# EAGLE design M100A (EAGLE 6.6.0)
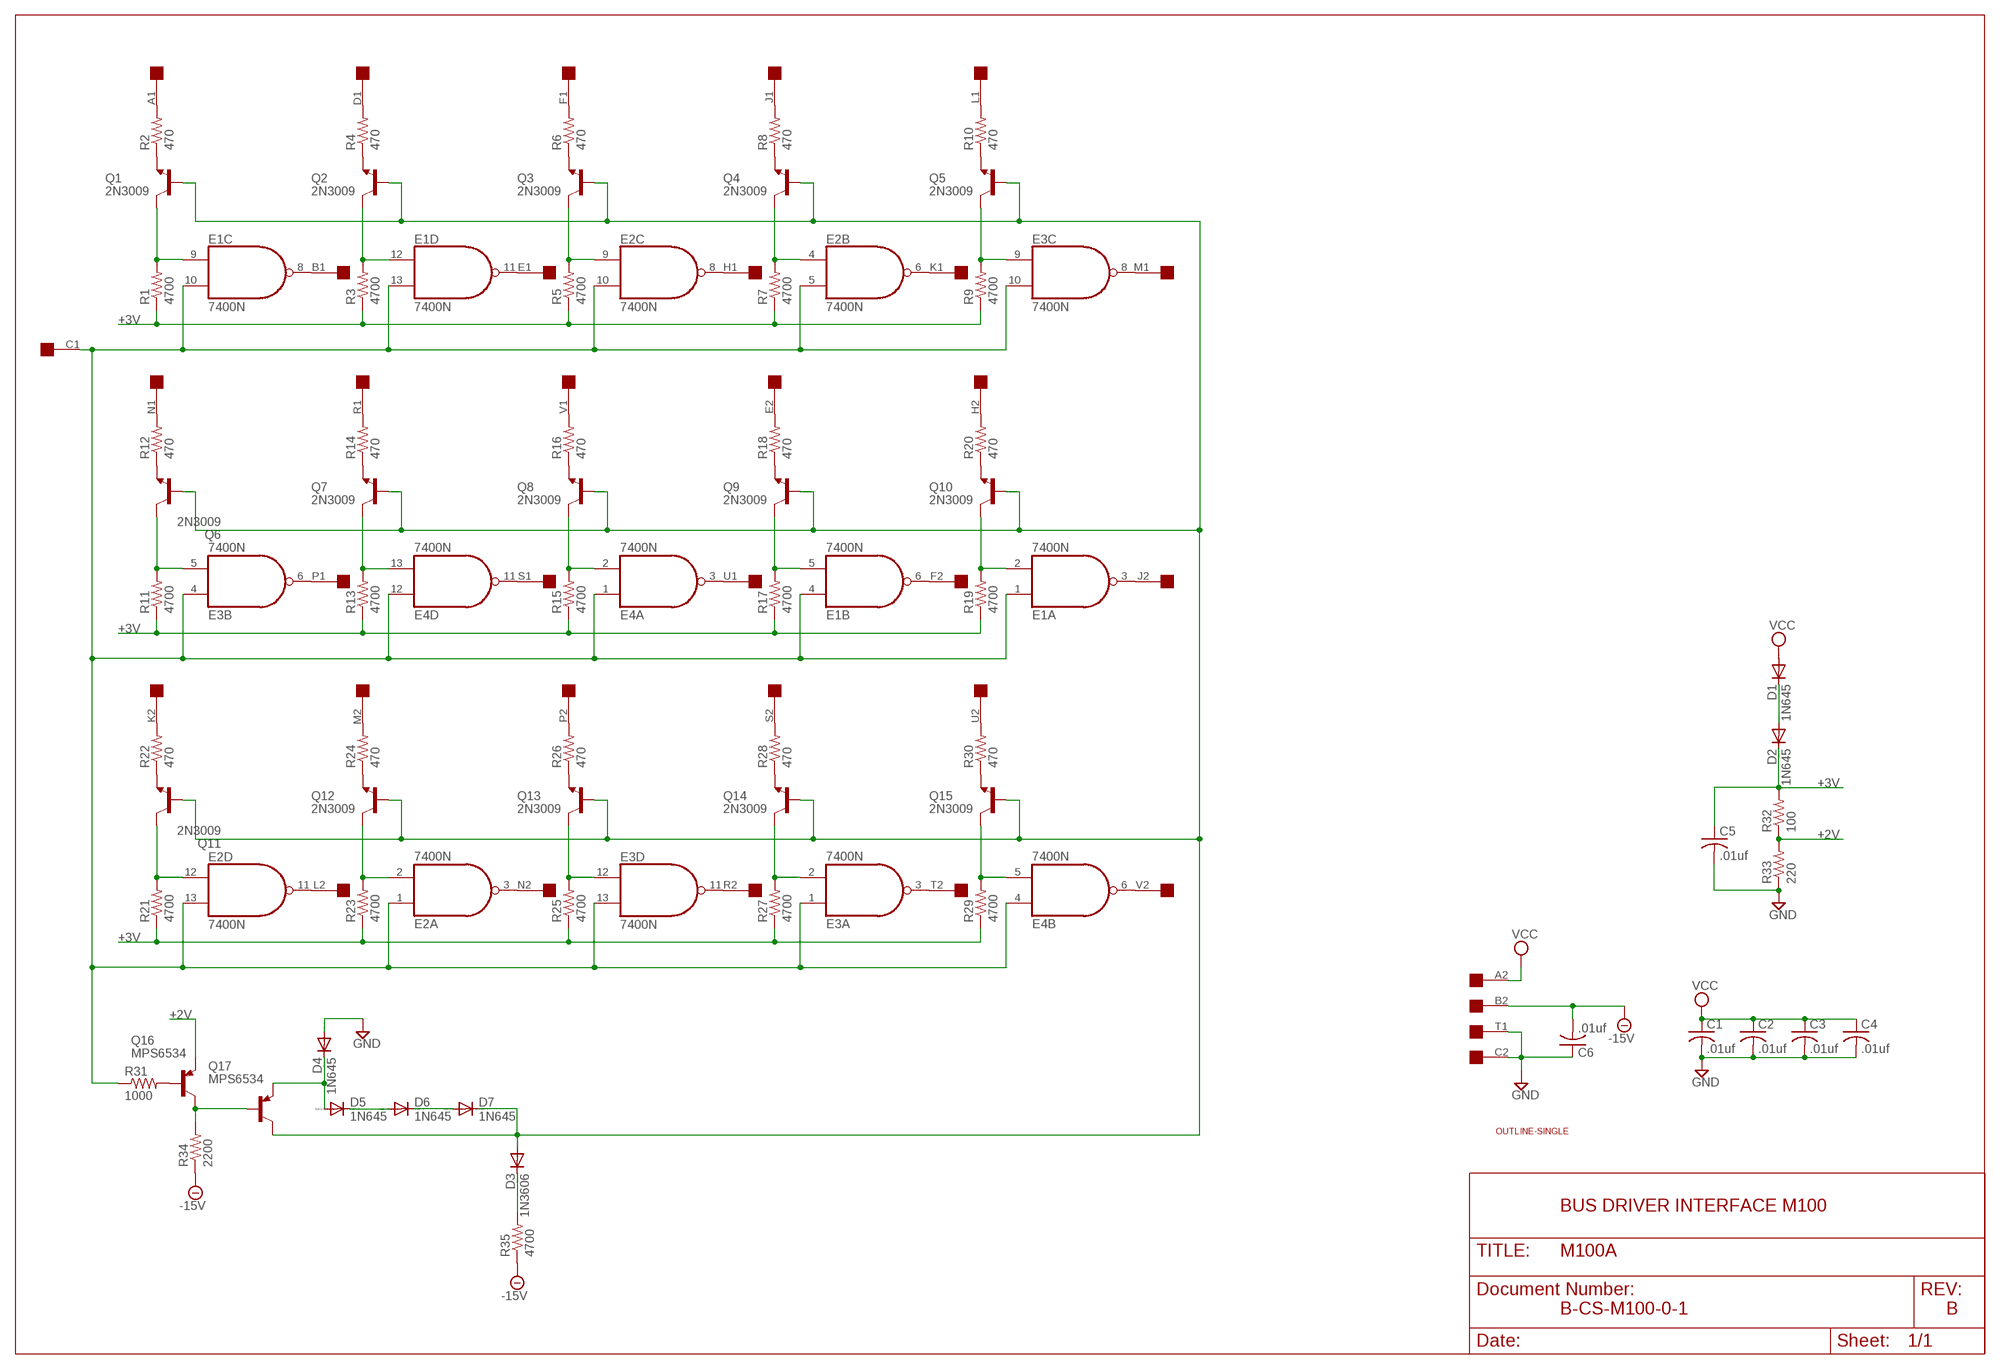
[diagram p0: schematic, sheet 1]

## Parts
C1  .01uf  C-US050-025X075  [C050-025X075]
C2  .01uf  C-US050-025X075  [C050-025X075]
C3  .01uf  C-US050-025X075  [C050-025X075]
C4  .01uf  C-US050-025X075  [C050-025X075]
C5  .01uf  C-US050-025X075  [C050-025X075]
C6  .01uf  C-US050-025X075  [C050-025X075]
D1  1N645  1N4148DO35-10  [DO35-10]
D2  1N645  1N4148DO35-10  [DO35-10]
D3  1N3606  1N4148DO35-10  [DO35-10]
D4  1N645  1N4148DO35-10  [DO35-10]
D5  1N645  1N4148DO35-10  [DO35-10]
D6  1N645  1N4148DO35-10  [DO35-10]
D7  1N645  1N4148DO35-10  [DO35-10]
E1  7400N  [DIL14]
E2  7400N  [DIL14]
E3  7400N  [DIL14]
E4  7400N  [DIL14]
Q1  2N3009  2N2219  [TO5]
Q2  2N3009  2N2219  [TO5]
Q3  2N3009  2N2219  [TO5]
Q4  2N3009  2N2219  [TO5]
Q5  2N3009  2N2219  [TO5]
Q6  2N3009  2N2219  [TO5]
Q7  2N3009  2N2219  [TO5]
Q8  2N3009  2N2219  [TO5]
Q9  2N3009  2N2219  [TO5]
Q10  2N3009  2N2219  [TO5]
Q11  2N3009  2N2219  [TO5]
Q12  2N3009  2N2219  [TO5]
Q13  2N3009  2N2219  [TO5]
Q14  2N3009  2N2219  [TO5]
Q15  2N3009  2N2219  [TO5]
Q16  MPS6534  -PNP-TO5  [TO5]
Q17  MPS6534  -PNP-TO5  [TO5]
R1  4700  R-US_0207/10  [0207/10]
R2  470  R-US_0207/10  [0207/10]
R3  4700  R-US_0207/10  [0207/10]
R4  470  R-US_0207/10  [0207/10]
R5  4700  R-US_0207/10  [0207/10]
R6  470  R-US_0207/10  [0207/10]
R7  4700  R-US_0207/10  [0207/10]
R8  470  R-US_0207/10  [0207/10]
R9  4700  R-US_0207/10  [0207/10]
R10  470  R-US_0207/10  [0207/10]
R11  4700  R-US_0207/10  [0207/10]
R12  470  R-US_0207/10  [0207/10]
R13  4700  R-US_0207/10  [0207/10]
R14  470  R-US_0207/10  [0207/10]
R15  4700  R-US_0207/10  [0207/10]
R16  470  R-US_0207/10  [0207/10]
R17  4700  R-US_0207/10  [0207/10]
R18  470  R-US_0207/10  [0207/10]
R19  4700  R-US_0207/10  [0207/10]
R20  470  R-US_0207/10  [0207/10]
R21  4700  R-US_0207/10  [0207/10]
R22  470  R-US_0207/10  [0207/10]
R23  4700  R-US_0207/10  [0207/10]
R24  470  R-US_0207/10  [0207/10]
R25  4700  R-US_0207/10  [0207/10]
R26  470  R-US_0207/10  [0207/10]
R27  4700  R-US_0207/10  [0207/10]
R28  470  R-US_0207/10  [0207/10]
R29  4700  R-US_0207/10  [0207/10]
R30  470  R-US_0207/10  [0207/10]
R31  1000  R-US_0207/10  [0207/10]
R32  100  R-US_0207/10  [0207/10]
R33  220  R-US_0207/10  [0207/10]
R34  2200  R-US_0207/10  [0207/10]
R35  4700  R-US_0207/10  [0207/10]
U$1  SINGLE  [EDGE-CON2]
U$2  OUTLINE-SINGLE  [SINGLE]

## Nets
+2V: Q16.1(E) R32.1 R33.2
+3V: C5.1 D2.C R1.1 R3.1 R5.1 R7.1 R9.1 R11.1 R13.1 R15.1 R17.1 R19.1 R21.1 R23.1 R25.1 R27.1 R29.1 R32.2
-15V: C6.2 R34.1 R35.1 U$1.B2
GND [Supply]: C1.2 C2.2 C3.2 C4.2 C5.2 C6.1 D4.A R33.1 U$1.C2 U$1.T1
N$1: Q1.1(E) R2.1
N$2: E1.9(C:I0) Q1.3(C) R1.2
N$4: E1.1(A:I0) E1.4(B:I0) E1.10(C:I1) E1.13(D:I1) E2.1(A:I0) E2.5(B:I1) E2.10(C:I1) E2.13(D:I1) E3.1(A:I0) E3.4(B:I0) E3.10(C:I1) E3.13(D:I1) E4.1(A:I0) E4.4(B:I0) E4.12(D:I0) R31.1 U$1.C1
N$5: E1.12(D:I0) Q2.3(C) R3.2
N$6: E1.8(C:O) U$1.B1
N$7: Q2.1(E) R4.1
N$8: R4.2 U$1.D1
N$9: E1.11(D:O) U$1.E1
N$10: R6.2 U$1.F1
N$11: Q3.1(E) R6.1
N$12: E2.9(C:I0) Q3.3(C) R5.2
N$13: E2.8(C:O) U$1.H1
N$14: R8.2 U$1.J1
N$15: Q4.1(E) R8.1
N$16: E2.4(B:I0) Q4.3(C) R7.2
N$17: E2.6(B:O) U$1.K1
N$18: R10.2 U$1.L1
N$19: E3.8(C:O) U$1.M1
N$20: E3.9(C:I0) Q5.3(C) R9.2
N$21: Q5.1(E) R10.1
N$22: D3.A D7.C Q1.2(B) Q2.2(B) Q3.2(B) Q4.2(B) Q5.2(B) Q6.2(B) Q7.2(B) Q8.2(B) Q9.2(B) Q10.2(B) Q11.2(B) Q12.2(B) Q13.2(B) Q14.2(B) Q15.2(B) Q17.3(C)
N$23: R12.2 U$1.N1
N$24: Q6.1(E) R12.1
N$25: E3.5(B:I1) Q6.3(C) R11.2
N$26: E3.6(B:O) U$1.P1
N$27: E4.11(D:O) U$1.S1
N$28: Q7.1(E) R14.1
N$29: R14.2 U$1.R1
N$30: E4.13(D:I1) Q7.3(C) R13.2
N$31: E4.3(A:O) U$1.U1
N$32: R16.2 U$1.V1
N$33: R2.2 U$1.A1
N$34: E4.2(A:I1) Q8.3(C) R15.2
N$35: R18.2 U$1.E2
N$36: E1.6(B:O) U$1.F2
N$37: R20.2 U$1.H2
N$38: Q8.1(E) R16.1
N$39: Q9.1(E) R18.1
N$40: E1.5(B:I1) Q9.3(C) R17.2
N$41: E1.3(A:O) U$1.J2
N$42: R22.2 U$1.K2
N$43: E1.2(A:I1) Q10.3(C) R19.2
N$44: Q10.1(E) R20.1
N$45: Q11.1(E) R22.1
N$46: E2.12(D:I0) Q11.3(C) R21.2
N$47: E2.11(D:O) U$1.L2
N$48: R24.2 U$1.M2
N$49: Q12.1(E) R24.1
N$50: E2.3(A:O) U$1.N2
N$51: E2.2(A:I1) Q12.3(C) R23.2
N$52: R26.2 U$1.P2
N$53: E3.11(D:O) U$1.R2
N$54: E3.12(D:I0) Q13.3(C) R25.2
N$55: R28.2 U$1.S2
N$56: E3.3(A:O) U$1.T2
N$57: R30.2 U$1.U2
N$58: Q13.1(E) R26.1
N$59: Q14.1(E) R28.1
N$60: E3.2(A:I1) Q14.3(C) R27.2
N$61: E4.6(B:O) U$1.V2
N$62: D1.C D2.A
N$63: E4.5(B:I1) Q15.3(C) R29.2
N$64: Q15.1(E) R30.1
N$65: D3.C R35.2
N$66: D5.C D6.A
N$67: D6.C D7.A
N$68: Q16.2(B) R31.2
N$69: Q16.3(C) Q17.2(B) R34.2
N$70: D4.C D5.A Q17.1(E)
VCC [Supply]: C1.1 C2.1 C3.1 C4.1 D1.A U$1.A2
Unconnected: E4.8(C:O) E4.9(C:I0) E4.10(C:I1) U$1.D2

## Notes on the sheet
- BUS DRIVER INTERFACE M100
- B-CS-M100-0-1 | B

## Power pins joined to a net without a drawn wire
GND: E1.7(P:GND) E2.7(P:GND) E3.7(P:GND) E4.7(P:GND)
VCC: E1.14(P:VCC) E2.14(P:VCC) E3.14(P:VCC) E4.14(P:VCC)

## Library data of the parts
C1-C6 = rcl:C-US: CAPACITOR, American symbol
D1-D7 = diode:1N4148: DIODE high speed (Philips)
E1-E4 = 74xx-us:74*00: Quad 2-input NAND gate
Q1-Q15 = transistor:2N2219: NPN TRANSISTOR
Q16 Q17 = transistor:*-PNP-: PNP Transistror
R1-R35 = rcl:R-US_: RESISTOR, American symbol
U$1 = dec-con:SINGLE: Single-Height DEC board
U$2 = dec-con:OUTLINE-*: Board outlines for DEC boards.

## Net classes
1 Supply: width 0.813 mm
2 HighCurrent: width 1.422 mm

## Board
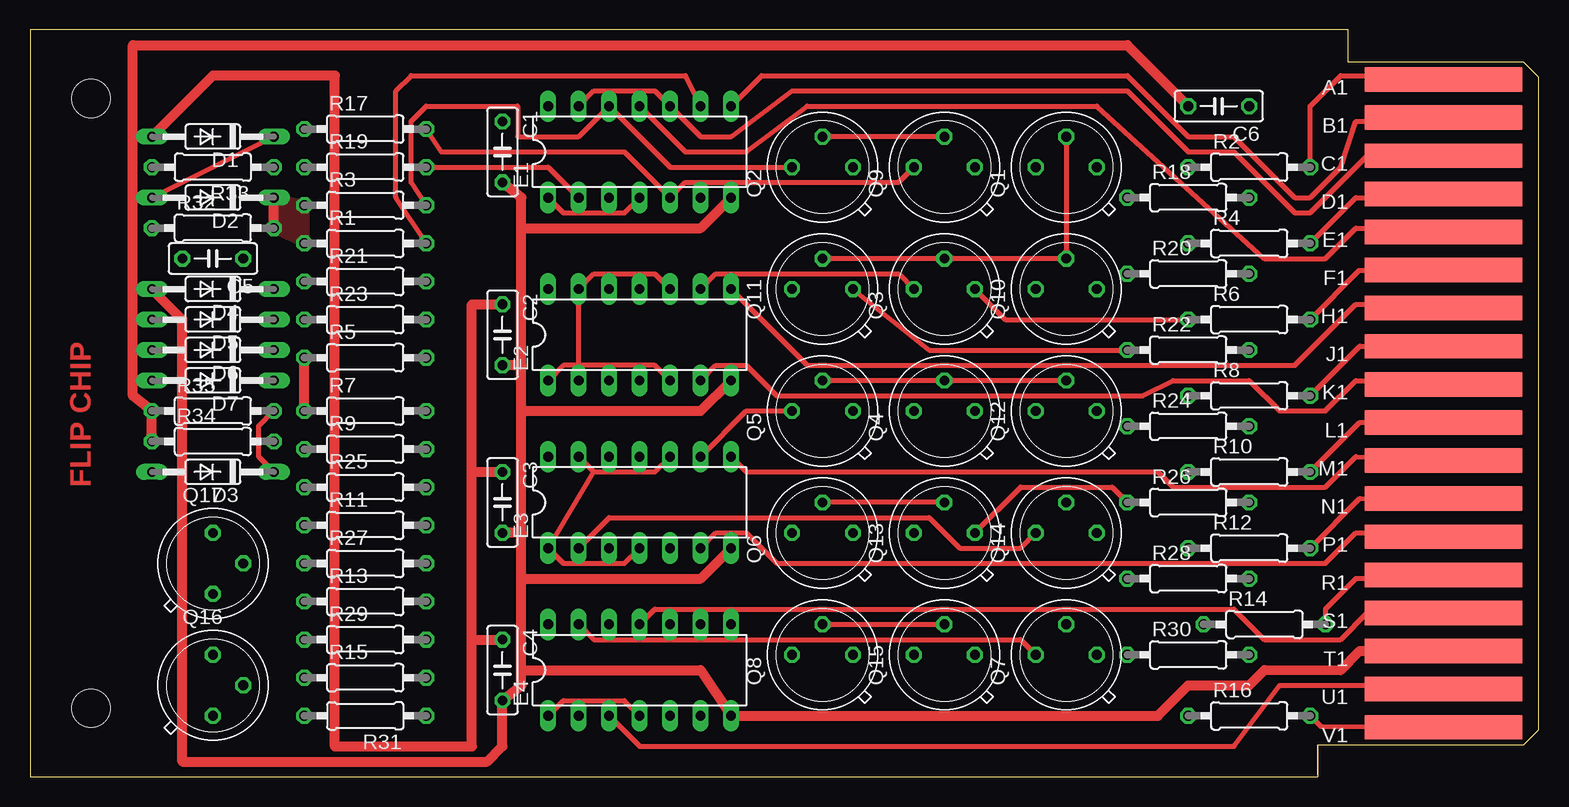
[diagram p1: board, top side]
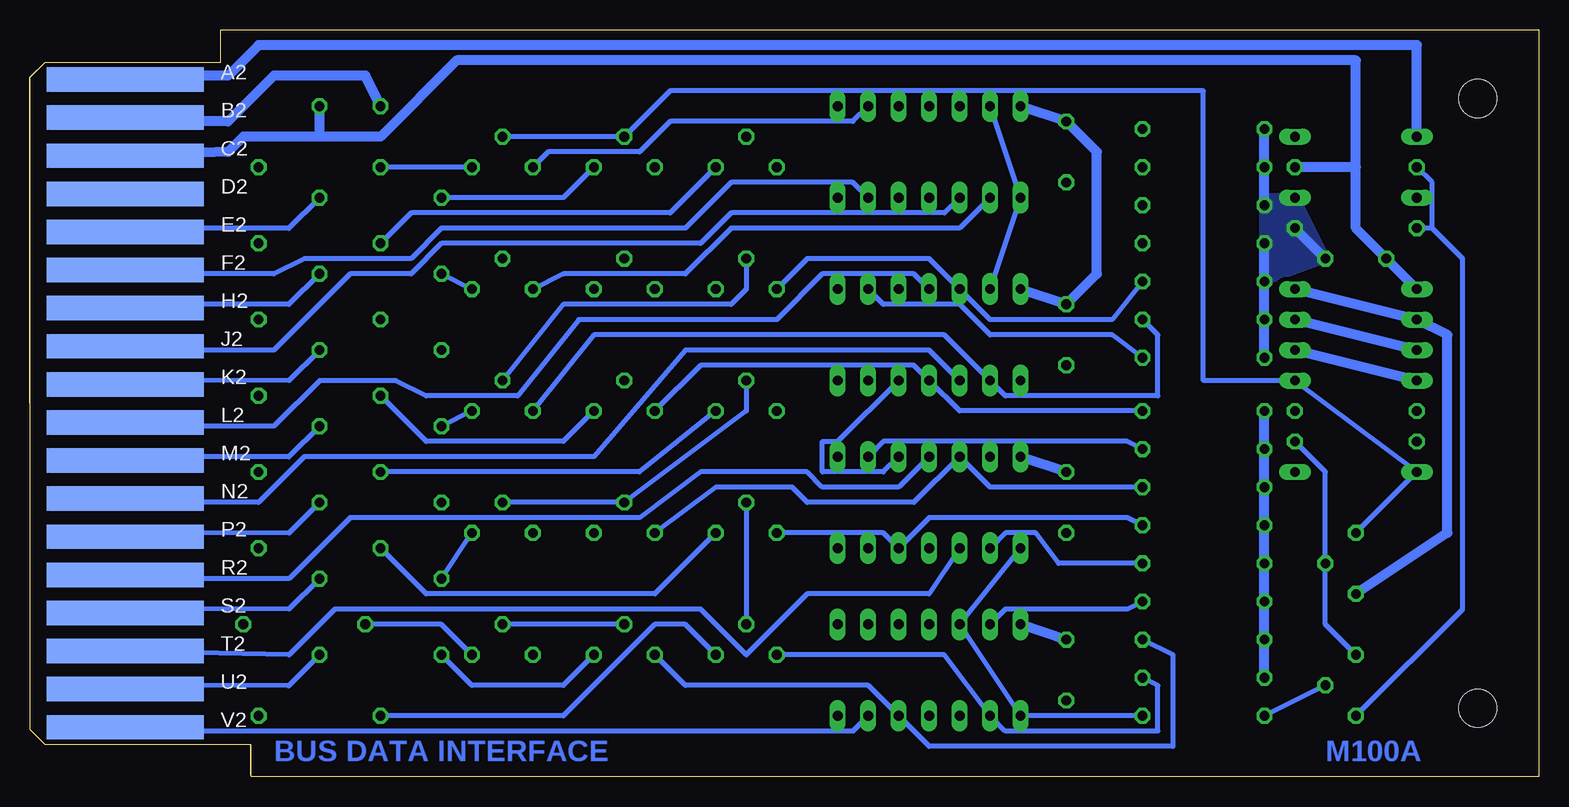
[diagram p2: board, bottom side, seen from below]

Size 125.73 x 62.23 mm. Coordinates in mm from the lower left corner, seen from the top.
Copper layers (1+16): Top 0.035mm / dielectric 1.5mm / Bottom 0.035mm
Design rules "16mils": minimum track width 16mil, minimum drill 32mil, track to track 15mil, track to pad 10mil, pad to pad 10mil, via to via 10mil, smd to smd 10mil, copper to edge 13mil, drill to drill 10mil, minimum pad ring 10mil, minimum via ring 8mil, stop-mask expansion 0mil, vias tented up to drill 0mil, thermal gap 10mil

### Footprints (pad centres in the part's own frame; a part is rotated, then mirrored left to right if it is on the bottom)
C050-025X075 = drill 0.813 octagon: 1 -2.54,0; 2 2.54,0
DO35-10 = drill 0.813 long: A 5.08,0; C -5.08,0
DIL14 = drill 0.813 long: 1 -7.62,-3.81; 2 -5.08,-3.81; 3 -2.54,-3.81; 4 0,-3.81; 5 2.54,-3.81; 6 5.08,-3.81; 7 7.62,-3.81; 8 7.62,3.81; 9 5.08,3.81; 10 2.54,3.81; 11 0,3.81; 12 -2.54,3.81; 13 -5.08,3.81; 14 -7.62,3.81
TO5 = drill 0.813 octagon: 1 0,-2.54; 2 2.54,0; 3 0,2.54
0207/10 = drill 0.813 octagon: 1 -5.08,0; 2 5.08,0
EDGE-CON2 = smd 13.106 x 2.032: A1 7.938,4.128; B1 7.938,7.303; C1 7.938,10.477; D1 7.938,13.652; E1 7.938,16.828; F1 7.938,20.003; H1 7.938,23.177; J1 7.938,26.352; K1 7.938,29.527; L1 7.938,32.703; M1 7.938,35.877; N1 7.938,39.053; P1 7.938,42.227; R1 7.938,45.403; S1 7.938,48.578; T1 7.938,51.752; U1 7.938,54.928; V1 7.938,58.102 | smd 13.106 x 2.032 bottom: A2 7.938,4.128; B2 7.938,7.303; C2 7.938,10.477; D2 7.938,13.652; E2 7.938,16.828; F2 7.938,20.003; H2 7.938,23.177; J2 7.938,26.352; K2 7.938,29.527; L2 7.938,32.703; M2 7.938,35.877; N2 7.938,39.053; P2 7.938,42.227; R2 7.938,45.403; S2 7.938,48.578; T2 7.938,51.752; U2 7.938,54.928; V2 7.938,58.102
SINGLE = hole 3.175: 120.65,56.515; 120.65,5.715

### Placement (x,y rotation side)
C1  39.37,52.07 270 top
C2  39.37,36.83 270 top
C3  39.37,22.86 270 top
C4  39.37,8.89 270 top
C5  15.24,43.18 180 top
C6  99.06,55.88 180 top
D1  15.24,53.34 180 top
D2  15.24,48.26 180 top
D3  15.24,25.4 180 top
D4  15.24,40.64 180 top
D5  15.24,38.1 180 top
D6  15.24,35.56 180 top
D7  15.24,33.02 180 top
E1  50.8,52.07 0 top
E2  50.8,36.83 0 top
E3  50.8,22.86 0 top
E4  50.8,8.89 0 top
Q1  86.36,50.8 90 top
Q2  66.04,50.8 90 top
Q3  76.2,40.64 90 top
Q4  76.2,30.48 90 top
Q5  66.04,30.48 90 top
Q6  66.04,20.32 90 top
Q7  86.36,10.16 90 top
Q8  66.04,10.16 90 top
Q9  76.2,50.8 90 top
Q10  86.36,40.64 90 top
Q11  66.04,40.64 90 top
Q12  86.36,30.48 90 top
Q13  76.2,20.32 90 top
Q14  86.36,20.32 90 top
Q15  76.2,10.16 90 top
Q16  15.24,7.62 0 top
Q17  15.24,17.78 0 top
R1  27.94,44.45 0 top
R2  101.6,50.8 0 top
R3  27.94,47.62 0 top
R4  101.6,44.45 0 top
R5  27.94,34.92 0 top
R6  101.6,38.1 0 top
R7  27.94,30.48 0 top
R8  101.6,31.75 0 top
R9  27.94,27.3 0 top
R10  101.6,25.4 0 top
R11  27.94,20.95 0 top
R12  101.6,19.05 0 top
R13  27.94,14.61 0 top
R14  102.87,12.7 0 top
R15  27.94,8.26 0 top
R16  101.6,5.08 0 top
R17  27.94,53.98 0 top
R18  96.52,48.26 0 top
R19  27.94,50.8 0 top
R20  96.52,41.91 0 top
R21  27.94,41.27 0 top
R22  96.52,35.56 0 top
R23  27.94,38.1 0 top
R24  96.52,29.21 0 top
R25  27.94,24.13 0 top
R26  96.52,22.86 0 top
R27  27.94,17.78 0 top
R28  96.52,16.51 0 top
R29  27.94,11.43 0 top
R30  96.52,10.16 0 top
R31  27.94,5.08 180 top
R32  15.24,45.72 0 top
R33  15.24,50.8 180 top
R34  15.24,27.94 0 top
R35  15.24,30.48 0 top
U$1  125.73,62.23 180 top
U$2  125.73,62.23 180 top

### Tracks (layer width: path | path; a pad name or v marks a point on that pad's centre or on a via)
+2V
  Bottom 0.406: Q16.1 6.35,13.97 6.35,43.18 8.89,45.72 | 8.89,45.72 R32.1 | R33.2 8.89,49.53 8.89,45.72
+3V
  Top 0.813: R32.2 D2.C | R7.1 R5.1
  Bottom 0.813: R15.1 R29.1 R13.1 R27.1 R11.1 R25.1 R9.1 R7.1 | C5.1 R32.2 | R17.1 R19.1 R3.1 | R1.1 R21.1 R23.1 R5.1
  pour Top (no thermals): 20.32,48.26 22.86,47.62 22.86,44.45 20.32,45.72
  pour Bottom (no thermals): 17.78,43.18 22.86,41.27 22.86,48.26 20.32,48.26
-15V
  Top 0.813: R34.1 R35.1 8.57,31.75 8.57,60.96 91.44,60.96 C6.2
  Bottom 0.813: U$1.B2 111.76,54.61 109.22,54.61 105.41,58.42 97.79,58.42 C6.2
GND
  Top 0.813: U$1.T1 113.03,10.16 112.7,10.49 110.82,10.49 109.22,8.89 102.88,8.9 101.6,7.62 96.52,7.62 93.98,5.08 E4.7 55.88,8.89 40.96,8.89 | 40.96,8.89 40.96,7.62 C4.2 39.37,2.54 38.1,1.27 12.7,1.27 12.7,38.1 D4.A | 40.96,8.89 40.96,16.51 | 40.96,16.51 40.96,20.32 | 40.96,20.32 C3.2 | C1.2 40.96,48.26 40.96,45.72 | 40.96,20.32 40.96,30.48 | 40.96,30.48 40.96,34.29 | 40.96,34.29 40.96,45.72 | 40.96,34.29 C2.2 | E3.7 55.88,16.51 40.96,16.51 | E2.7 55.88,30.48 40.96,30.48 | E1.7 55.88,45.72 40.96,45.72
  Bottom 0.813: U$1.C2 109.22,52.07 107.95,53.34 101.6,53.34 | 101.6,53.34 96.52,53.34 90.17,59.69 15.24,59.69 15.24,50.8 | 101.6,53.34 C6.1 | 15.24,50.8 R33.1 | 15.24,50.8 15.24,45.72 C5.2 D4.A
N$1
  Bottom 0.406: Q1.1 R2.1
N$2
  Top 0.406: R1.2 30.48,48.26 30.48,57.15 31.75,58.42 54.61,58.42 E1.9
  Bottom 0.406: E1.9 57.15,54.61 72.39,54.61 74.93,52.07 82.55,52.07 Q1.3
N$4
  Top 0.406: U$1.C1 111.76,52.07 106.68,46.99 105.41,46.99 100.33,52.07 96.52,52.07 91.44,57.15 63.5,57.15 58.42,53.34 55.88,53.34 E1.10 52.07,57.15 46.99,57.15 E1.13 | E1.1 44.45,46.99 49.53,46.99 E1.4 | E2.10 52.07,41.91 46.99,41.91 E2.13 45.72,34.29 | E3.4 49.53,17.78 44.45,17.78 E3.1 46.99,25.4 | 46.99,25.4 E3.13 | 46.99,25.4 52.07,25.4 E3.10 | E4.1 44.45,6.35 49.53,6.35 E4.4 | E2.1 44.45,34.29 45.72,34.29 | 45.72,34.29 52.07,34.29 E2.5
  Bottom 0.406: E1.13 E1.1 E2.13 | E3.1 E4.12 E4.1 R31.1 | E3.10 54.61,25.4 59.69,25.4 59.69,27.94 58.42,27.94 E2.5
N$5
  Top 0.406: R3.2 31.75,49.53 31.75,54.61 33.02,55.88 40.64,55.88 40.64,53.34 45.72,53.34 E1.12 53.34,50.8 Q2.3
N$6
  Top 0.406: U$1.B1 111.76,54.61 110.49,54.61 109.22,50.8 106.68,48.26 105.41,48.26 100.33,53.34 96.52,53.34 91.44,58.42 60.96,58.42 E1.8
N$7
  Bottom 0.406: R4.1 93.98,46.99 72.39,46.99 Q2.1
N$8
  Top 0.406: U$1.D1 111.76,48.56 111.76,48.26 110.49,48.26 R4.2
N$9
  Top 0.406: U$1.E1 111.76,45.72 110.49,45.72 107.95,43.18 102.87,43.18 88.9,55.88 64.77,55.88 59.69,52.07 54.61,52.07 E1.11
N$10
  Top 0.406: U$1.F1 110.77,42.19 R6.2
N$11
  Top 0.406: R6.1 81.28,38.1 Q3.1
N$12
  Top 0.406: E2.9 57.15,41.91 72.39,41.91 Q3.3
  Bottom 0.406: R5.2 35.56,36.83 45.72,36.83 48.26,39.37 54.61,39.37 E2.9
N$13
  Top 0.406: U$1.H1 111.76,39.37 110.49,39.37 105.41,34.29 64.77,34.29 E2.8
N$14
  Top 0.406: U$1.J1 110.82,35.89 R8.2
N$15
  Bottom 0.406: R8.1 92.71,27.94 81.28,27.94 Q4.1
N$16
  Bottom 0.406: R7.2 48.26,30.48 E2.4 52.07,34.29 69.85,34.29 Q4.3
N$17
  Top 0.406: U$1.K1 111.76,33.02 110.49,33.02 107.95,30.48 104.14,30.48 101.6,33.02 95.25,33.02 92.71,31.75 62.23,31.75 59.69,34.29 57.15,34.29 E2.6
N$18
  Top 0.406: U$1.L1 110.82,29.54 R10.2
N$19
  Top 0.406: U$1.M1 110.49,26.67 107.95,24.13 95.25,24.13 93.98,25.4 59.69,25.4 E3.8
N$20
  Top 0.406: Q5.3 59.69,30.48 E3.9
  Bottom 0.406: R9.2 34.29,27.94 54.61,27.94 E3.9
N$21
  Bottom 0.406: R10.1 74.93,25.4 Q5.1
N$22
  Top 0.406: Q9.2 Q2.2 | Q11.2 Q3.2 Q10.2 Q1.2 | Q12.2 Q4.2 Q5.2 | Q13.2 Q6.2 | Q8.2 Q15.2
  Bottom 0.406: Q17.3 D3.A D7.C 27.94,33.02 27.94,57.15 72.39,57.15 Q9.2 Q1.2 | Q15.2 Q7.2 | Q14.2 Q13.2 66.04,30.48 Q5.2 | Q12.2 81.28,39.37 67.31,39.37 66.04,40.64 Q11.2 | Q6.2 Q8.2
N$23
  Top 0.406: U$1.N1 110.82,23.19 R12.2
N$24
  Bottom 0.406: Q6.1 73.66,15.24 92.71,15.24 R12.1
N$25
  Bottom 0.406: R11.2 34.29,21.59 50.8,21.59 E3.5 54.61,20.32 Q6.3
N$26
  Top 0.406: U$1.P1 112.09,19.99 111.76,20.32 110.49,20.32 107.95,17.78 62.23,17.78 59.69,20.32 57.15,20.32 E3.6
N$27
  Top 0.406: U$1.S1 111.45,13.66 109.22,11.43 102.87,11.43 100.33,13.97 52.07,13.97 E4.11
N$28
  Bottom 0.406: R14.1 91.44,12.7 Q7.1
N$29
  Top 0.406: U$1.R1 116.84,16.51 116.84,16.84 116.51,16.51 110.49,16.51 107.95,13.97 R14.2
N$30
  Top 0.406: Q7.3 82.55,11.43 46.99,11.43 E4.13
  Bottom 0.406: R13.2 34.29,13.97 44.45,13.97 E4.13
N$31
  Top 0.406: U$1.U1 112.12,7.26 111.76,7.62 104.14,7.62 100.33,2.54 50.8,2.54 E4.3
N$32
  Top 0.406: U$1.V1 107.56,4.2 R16.2
N$33
  Top 0.406: U$1.A1 111.76,58.02 111.76,58.42 109.22,58.42 106.68,55.88 R2.2
N$34
  Bottom 0.406: Q8.3 49.53,10.16 E4.2 44.45,3.81 31.75,3.81 31.75,7.62 R15.2
N$35
  Bottom 0.406: U$1.E2 112.09,45.39 111.76,45.72 104.15,45.71 R18.2
N$36
  Bottom 0.406: E1.6 57.15,49.53 67.31,49.53 71.12,45.72 91.44,45.72 93.98,43.18 102.87,43.18 105.41,41.91 111.76,41.91 U$1.F2
N$37
  Bottom 0.406: U$1.H2 112.09,39.04 111.76,39.37 104.15,39.36 R20.2
N$38
  Bottom 0.406: R16.1 81.28,5.08 73.66,12.7 71.12,12.7 Q8.1
N$39
  Bottom 0.406: R18.1 81.28,48.26 Q9.1
N$40
  Top 0.406: R17.2 34.29,52.07 49.53,52.07 E1.5 54.61,49.53 72.39,49.53 Q9.3
N$41
  Bottom 0.406: E1.3 49.53,46.99 67.31,46.99 69.85,44.45 91.44,44.45 93.98,41.91 99.06,41.91 105.41,35.56 111.76,35.56 U$1.J2
N$42
  Bottom 0.406: U$1.K2 112.06,32.72 111.76,33.02 104.13,33.03 R22.2
N$43
  Top 0.406: R19.2 43.18,50.8 E1.2
  Bottom 0.406: E1.2 48.26,45.72 67.31,45.72 71.12,41.91 81.28,41.91 Q10.3
N$44
  Bottom 0.406: Q10.1 R20.1
N$45
  Top 0.406: R22.1 74.93,35.56 Q11.1
N$46
  Bottom 0.406: R21.2 35.56,38.1 45.72,38.1 E2.12 50.8,43.18 60.96,43.18 Q11.3
N$47
  Bottom 0.406: E2.11 52.07,41.91 59.69,41.91 63.5,38.1 80.01,38.1 85.09,31.75 92.71,31.75 95.25,33.02 101.6,33.02 105.41,29.21 111.76,29.21 U$1.L2
N$48
  Bottom 0.406: U$1.M2 112.09,26.34 111.76,26.67 104.15,26.66 R24.2
N$49
  Bottom 0.406: R24.1 Q12.1
N$50
  Bottom 0.406: E2.3 50.8,35.56 71.12,35.56 78.74,26.67 102.87,26.67 106.68,22.86 111.76,22.86 U$1.N2
N$51
  Bottom 0.406: R23.2 31.75,36.83 31.75,31.75 44.45,31.75 E2.2 49.53,36.83 78.74,36.83 Q12.3
N$52
  Bottom 0.406: U$1.P2 112.09,19.99 111.76,20.32 104.15,20.31 R26.2
N$53
  Bottom 0.406: E3.11 53.34,24.13 59.69,24.13 60.96,25.4 69.85,25.4 74.93,21.59 99.06,21.59 104.14,16.51 111.76,16.51 U$1.R2
N$54
  Bottom 0.406: R25.2 45.72,24.13 E3.12 52.07,22.86 60.96,22.86 62.23,24.13 68.58,24.13 Q13.3
N$55
  Bottom 0.406: U$1.S2 112.06,13.66 111.76,13.97 104.13,13.98 R28.2
N$56
  Bottom 0.406: U$1.T2 104.14,10.16 100.33,13.97 69.85,13.97 66.04,10.16 60.96,15.24 50.8,15.24 E3.3
N$57
  Bottom 0.406: U$1.U2 112.12,7.26 111.76,7.62 104.18,7.58 R30.2
N$58
  Top 0.406: R26.1 90.17,24.13 82.55,24.13 Q13.1
N$59
  Bottom 0.406: R28.1 Q14.1
N$60
  Top 0.406: Q14.3 82.55,19.05 77.47,19.05 74.93,21.59 48.26,21.59 E3.2
  Bottom 0.406: E3.2 44.45,20.32 41.91,20.32 40.01,17.78 R27.2
N$61
  Bottom 0.406: E4.6 57.15,3.81 111.76,3.81 U$1.V2
N$62
  Top 0.406: D2.A D1.C
N$63
  Bottom 0.406: R29.2 30.48,10.16 30.48,2.54 50.8,2.54 E4.5 55.88,7.62 71.12,7.62 Q15.3
N$64
  Bottom 0.406: R30.1 88.9,7.62 81.28,7.62 Q15.1
N$65
  Top 0.406: D3.C 19.05,26.67 19.05,29.21 R35.2
N$66
  Bottom 0.813: D6.A D5.C
N$67
  Bottom 0.813: D7.A D6.C
N$68
  Bottom 0.406: Q16.2 R31.2
N$69
  Bottom 0.406: Q16.3 17.78,12.7 Q17.2 17.78,25.4 R34.2
N$70
  Bottom 0.813: D4.C D5.A 7.62,36.83 7.62,20.32 Q17.1
VCC
  Top 0.813: 36.83,11.43 C4.1 | 36.83,11.43 36.83,25.4 | 36.83,25.4 C3.1 | C2.1 36.83,39.37 36.83,25.4 | D1.A 15.24,58.42 25.4,58.42 25.4,2.54 36.83,2.54 36.83,11.43
  Bottom 0.813: E1.14 C1.1 36.83,52.07 36.83,41.91 C2.1 E2.14 | C3.1 E3.14 | C4.1 E4.14 | U$1.A2 111.76,58.42 109.22,58.42 106.68,60.96 10.16,60.96 D1.A

### Text on the board
Top: FLIP CHIP
Bottom: M100A | BUS DATA INTERFACE